# EAGLE design mlc (EAGLE 5.11)
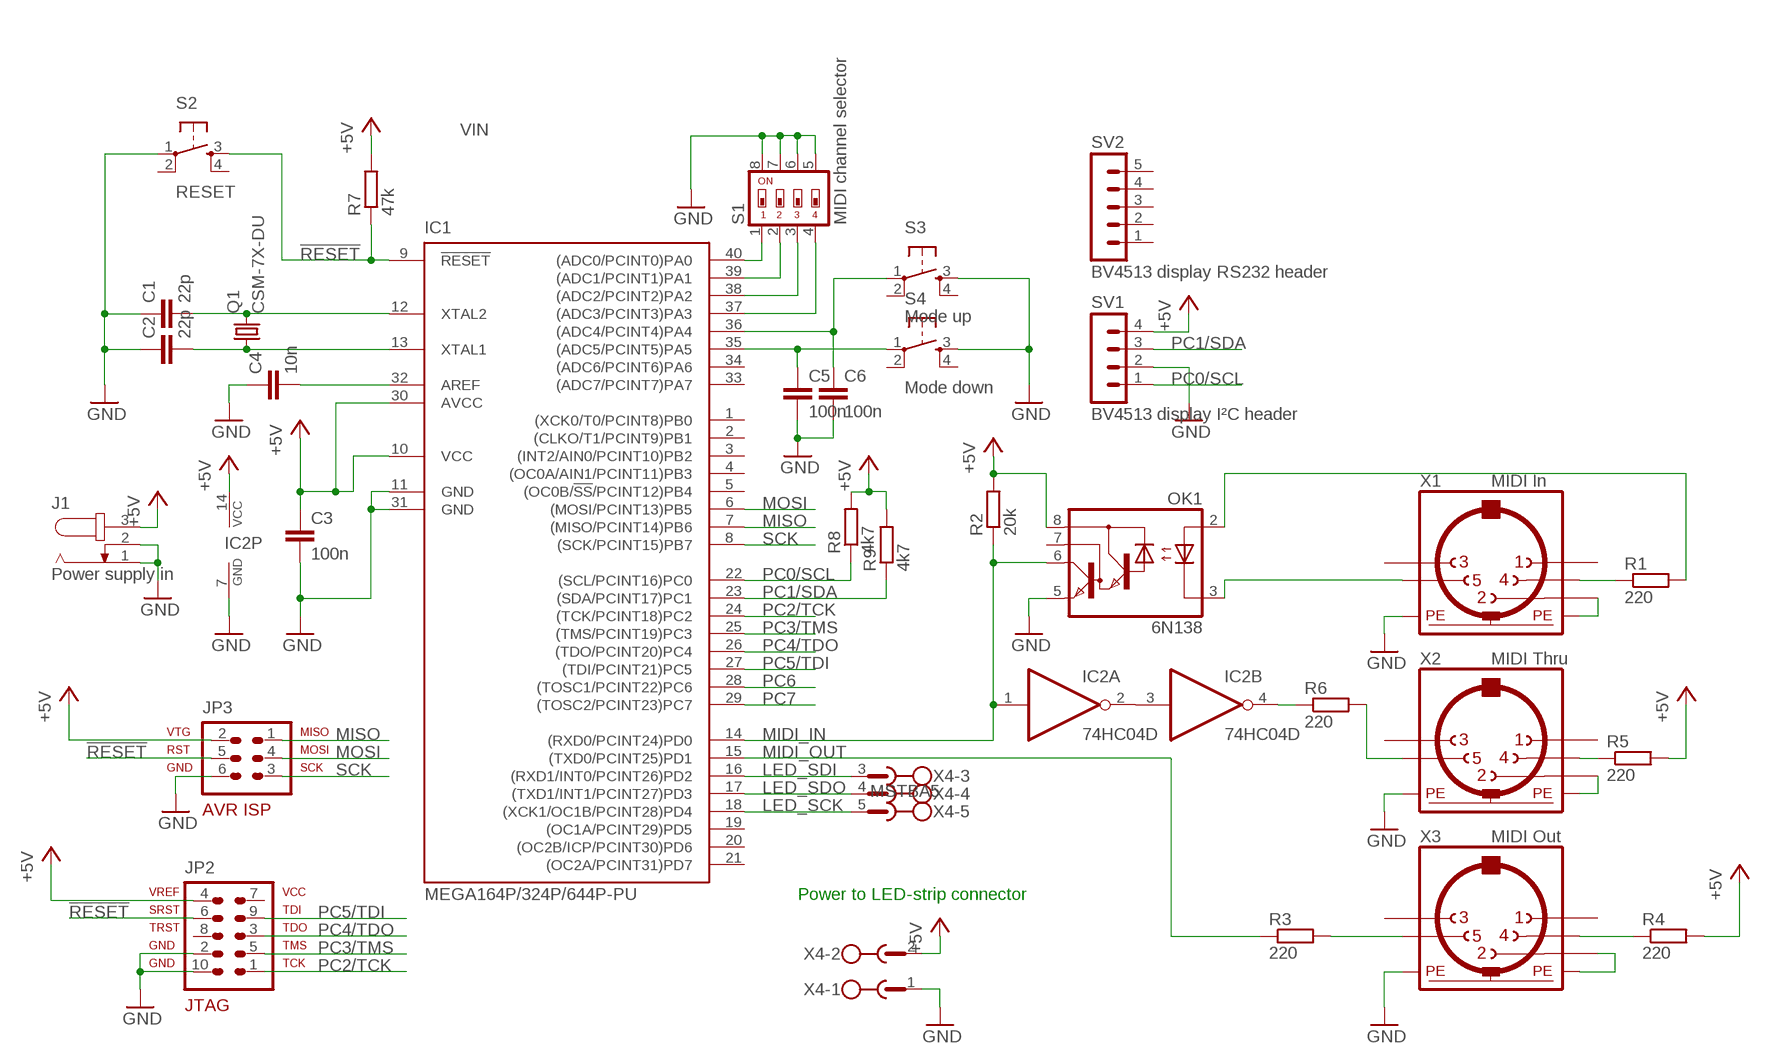
[diagram p0: schematic, sheet 1]

## Parts
C1  22p  C-EUC0603  [C0603]
C2  22p  C-EUC0603  [C0603]
C3  100n  C-EU025-030X050  [C025-030X050]
C4  10n  C-EUC0603  [C0603]
C5  100n  C-EUC0603  [C0603]
C6  100n  C-EUC0603  [C0603]
IC1  MEGA164P/324P/644P-PU  [DIL40]
IC2  74HC04D  [SO14]
J1  Power supply in  JACK-PLUG0  [SPC4077]
JP2  AVR-JTAG-10-R  [AVR-JTAG-10R]
JP3  AVR-ISP-6R  [AVR-ISP-6R]
OK1  6N138  [DIL08]
Q1  CSM-7X-DU  [CSM-7X-DU]
R1  220  R-EU_R0603  [R0603]
R2  20k  R-EU_0207/12  [0207/12]
R3  220  R-EU_R0603  [R0603]
R4  220  R-EU_R0603  [R0603]
R5  220  R-EU_R0603  [R0603]
R6  220  R-EU_R0603  [R0603]
R7  47k  R-EU_R0603  [R0603]
R8  4k7  R-EU_R0603  [R0603]
R9  4k7  R-EU_R0603  [R0603]
S1  MIDI channel selector  SWS004  [SMS-004]
S2  RESET  TAC_SWITCHPTH  [TACTILE-PTH]
S3  Mode up  TAC_SWITCHPTH  [TACTILE-PTH]
S4  Mode down  TAC_SWITCHPTH  [TACTILE-PTH]
SV1  BV4513 display I²C header  MA04-1  [MA04-1]
SV2  BV4513 display RS232 header  MA05-1  [MA05-1]
X1  MIDI In  MAB5SH  [MAB5SH]
X2  MIDI Thru  MAB5SH  [MAB5SH]
X3  MIDI Out  MAB5SH  [MAB5SH]
X4  MSTBA5  [MSTBA5]

## Nets
!RESET [signal]: IC1.9(!RESET) JP2.6 JP3.5 R7.1 S2.3
AREF: C4.2 IC1.32(AREF)
GND: C1.1 C2.1 C3.2 C4.1 C5.2 C6.2 IC1.11(GND) IC1.31(GND) IC2.7(P:GND) J1.1 J1.2 JP2.2 JP2.10 JP3.6 OK1.5(GND) S1.5 S1.6 S1.7 S1.8 S2.1 S3.3 S4.3 SV1.2 X1.PE@(PE) X2.PE@(PE) X3.PE@(PE) X4.1
LED_SCK [signal]: IC1.18((XCK1/OC1B/PCINT28)PD4) X4.5
LED_SDI [signal]: IC1.16((RXD1/INT0/PCINT26)PD2) X4.3
LED_SDO [signal]: IC1.17((TXD1/INT1/PCINT27)PD3) X4.4
MIDI_C1 [signal]: IC1.39((ADC1/PCINT1)PA1) S1.2
MIDI_C2 [signal]: IC1.38((ADC2/PCINT2)PA2) S1.3
MIDI_C3 [signal]: IC1.37((ADC3/PCINT3)PA3) S1.4
MIDI_IN [signal]: IC1.14((RXD0/PCINT24)PD0) IC2.1(A:I) OK1.6(VO) R2.1
MIDI_OUT [midipower]: IC1.15((TXD0/PCINT25)PD1) R3.1
MISO [signal]: IC1.7((MISO/PCINT14)PB6) JP3.1
MODE_DOWN [signal]: C5.1 IC1.35((ADC5/PCINT5)PA5) S4.1
MODE_UP [signal]: C6.1 IC1.36((ADC4/PCINT4)PA4) S3.1
MOSI [signal]: IC1.6((MOSI/PCINT13)PB5) JP3.4
N$1 [midipower]: OK1.3(C) X1.5
N$2 [midipower]: R1.1 X1.4
N$3 [midipower]: OK1.2(A) R1.2
N$4: X1.2 X1.PE
N$6 [midipower]: R3.2 X3.5
N$8: X3.2 X3.PE
N$9 [midipower]: R4.1 X3.4
N$10 [midipower]: R5.1 X2.4
N$11: IC2.2(A:O) IC2.3(B:I)
N$12 [midipower]: IC2.4(B:O) R6.1
N$13 [midipower]: R6.2 X2.5
N$14: X2.2 X2.PE
N$15: C1.2 IC1.12(XTAL2) Q1.2
N$16: C2.2 IC1.13(XTAL1) Q1.1
N$18 [signal]: IC1.40((ADC0/PCINT0)PA0) S1.1
PC0/SCL [signal]: IC1.22((SCL/PCINT16)PC0) R8.1 SV1.1
PC1/SDA [signal]: IC1.23((SDA/PCINT17)PC1) R9.1 SV1.3
PC2/TCK [signal]: IC1.24((TCK/PCINT18)PC2) JP2.1
PC3/TMS [signal]: IC1.25((TMS/PCINT19)PC3) JP2.5
PC4/TDO [signal]: IC1.26((TDO/PCINT20)PC4) JP2.3
PC5/TDI [signal]: IC1.27((TDI/PCINT21)PC5) JP2.9
PC6 [signal]: IC1.28((TOSC1/PCINT22)PC6)
PC7 [signal]: IC1.29((TOSC2/PCINT23)PC7)
SCK [signal]: IC1.8((SCK/PCINT15)PB7) JP3.3
VIN [power]: C3.1 IC1.10(VCC) IC1.30(AVCC) IC2.14(P:VCC) J1.3 JP2.4 JP3.2 OK1.8(VCC) R2.2 R4.2 R5.2 R7.2 R8.2 R9.2 SV1.4 X4.2 ; supply symbol labelled +5V
Unconnected: IC1.1((XCK0/T0/PCINT8)PB0) IC1.2((CLKO/T1/PCINT9)PB1) IC1.3((INT2/AIN0/PCINT10)PB2) IC1.4((OC0A/AIN1/PCINT11)PB3) IC1.5((OC0B/!SS!/PCINT12)PB4) IC1.19((OC1A/PCINT29)PD5) IC1.20((OC2B/ICP/PCINT30)PD6) IC1.21((OC2A/PCINT31)PD7) IC1.33((ADC7/PCINT7)PA7) IC1.34((ADC6/PCINT6)PA6) IC2.5(C:I) IC2.6(C:O) IC2.8(D:O) IC2.9(D:I) IC2.10(E:O) IC2.11(E:I) IC2.12(F:O) IC2.13(F:I) JP2.7 JP2.8 OK1.7(VB) S2.2 S2.4 S3.2 S3.4 S4.2 S4.4 SV2.1 SV2.2 SV2.3 SV2.4 SV2.5 X1.1 X1.3 X2.1 X2.3 X3.1 X3.3

## Notes on the sheet
- Power to LED-strip connector

## Library data of the parts
C1 C2 C4 = rcl:C-EU: CAPACITOR, European symbol
C3 C5 C6 = resistor:C-EU: CAPACITOR, European symbol
IC1 = avr-5:MEGA164P/324P/644P-PU
IC2 = 74xx-eu:74*04: Hex INVERTER
J1 = con-jack:JACK-PLUG: DC POWER JACK Power Jack, DC, Right Angle, Through Hole, Rated 5A at 16VDC, PC Terminals Distributor: Farnell (www.Farnell.de) Drawing: 84N1161.pdf / 84N1162.pdf Manufacturer: SPC Technology (www.spctechnology.com) Type: SPC4077 / SPC 4078; OC_FARNELL: unknown; OC_NEWARK: unknown
JP2 = avr-6:AVR-JTAG-10: AVR JTAG Debug/Programming Header
JP3 = avr-6:AVR-ISP-6: AVR ISP-6 Serial Programming Header
OK1 = optocoupler:6N138: MOTOROLA OPTO COUPLER; MF: VISHAY/TELEFUNKEN; MPN: 6N138; OC_FARNELL: 9860150; OC_NEWARK: 35K5294
Q1 = crystal:CSM-7X-DU: SMD CRYSTAL Source: www.ecsxtal.com .. Crystal 3.6864MHz CSM_7X_DU.PDF; OC_FARNELL: unknown; OC_NEWARK: unknown
R1 = rcl:R-EU_: RESISTOR, European symbol
R2-R9 = resistor:R-EU_: RESISTOR, European symbol
S1 = smd-special:SWS004: SMD Dip Switch 4 pol.
S2-S4 = SparkFun:TAC_SWITCH: Momentary Switch Button commonly used for reset or general input. Spark Fun Electronics SKU : COM-00097
SV1 = con-lstb:MA04-1: PIN HEADER; OC_FARNELL: unknown; OC_NEWARK: unknown
SV2 = con-lstb:MA05-1: PIN HEADER; OC_FARNELL: unknown; OC_NEWARK: unknown
X1-X3 = con-hirschmann:MAB5SH: Female CONNECTOR 5 pins 90 deg. with shield, horizontal (DIN 41524); OC_FARNELL: 809883; OC_NEWARK: unknown
X4 = con-phoenix-508:MSTBA5: PHOENIX; MPN: 1757271; OC_FARNELL: 3705201; OC_NEWARK: 71C4164

## Net classes
1 signal: width 0.051 mm
2 midipower: width 0.508 mm
3 power: width 0.508 mm, clearance 0.508 mm to class 1, clearance 0.508 mm to class 2, clearance 0.508 mm
4 digitsink: width 0.102 mm

## Board
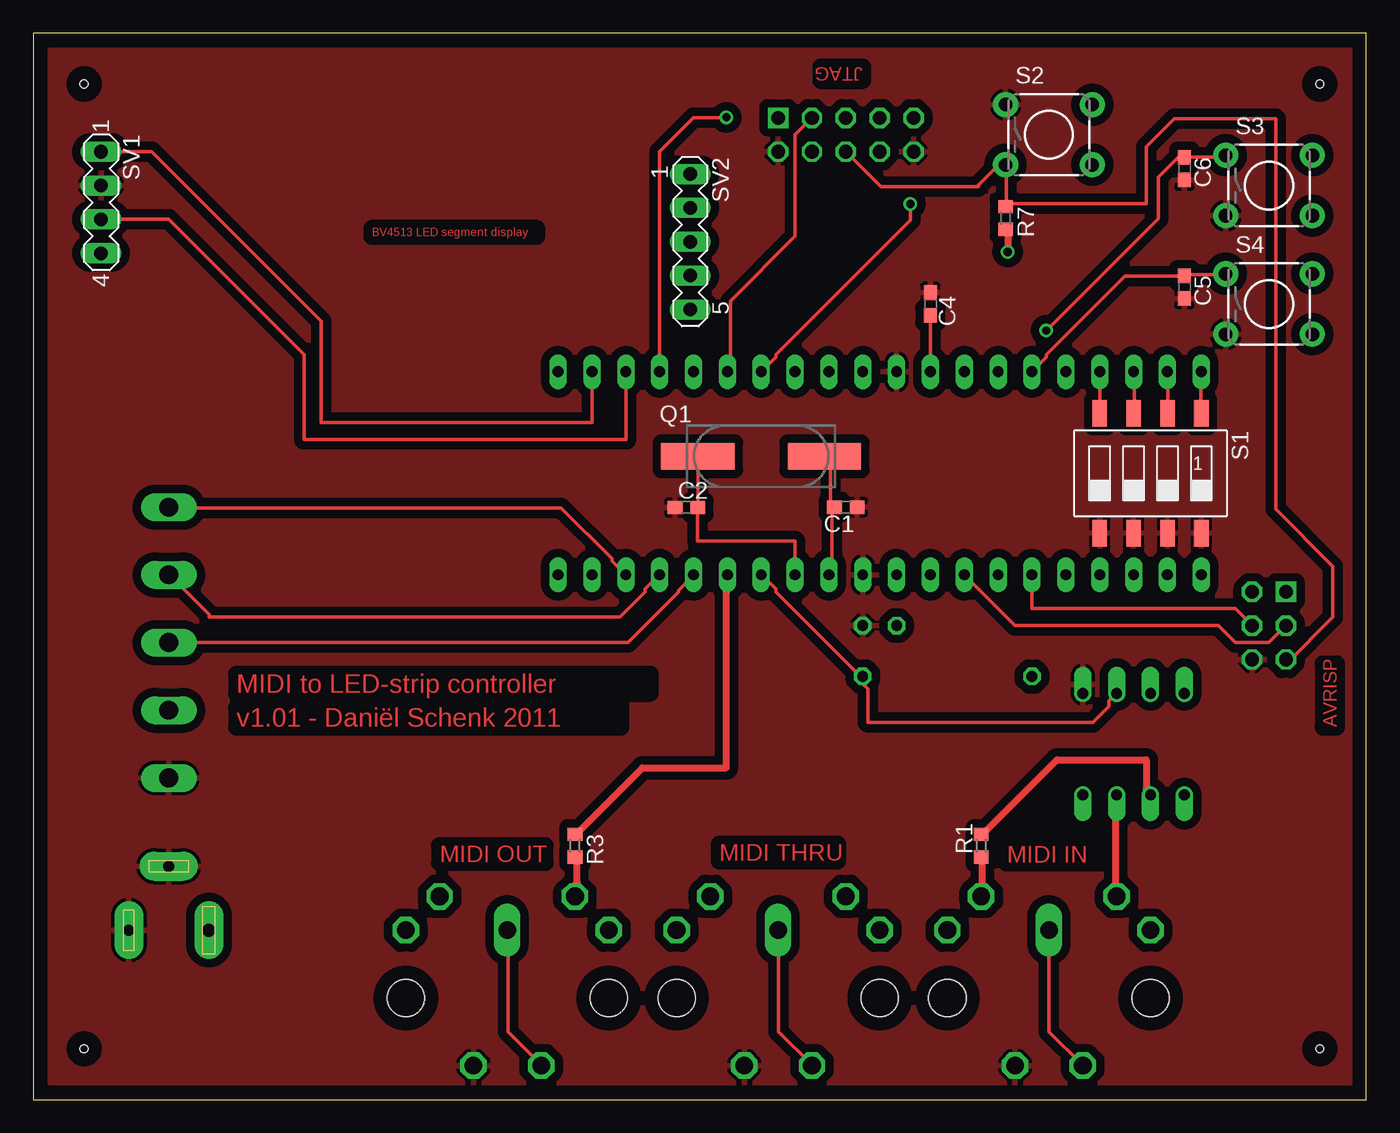
[diagram p1: board, top side]
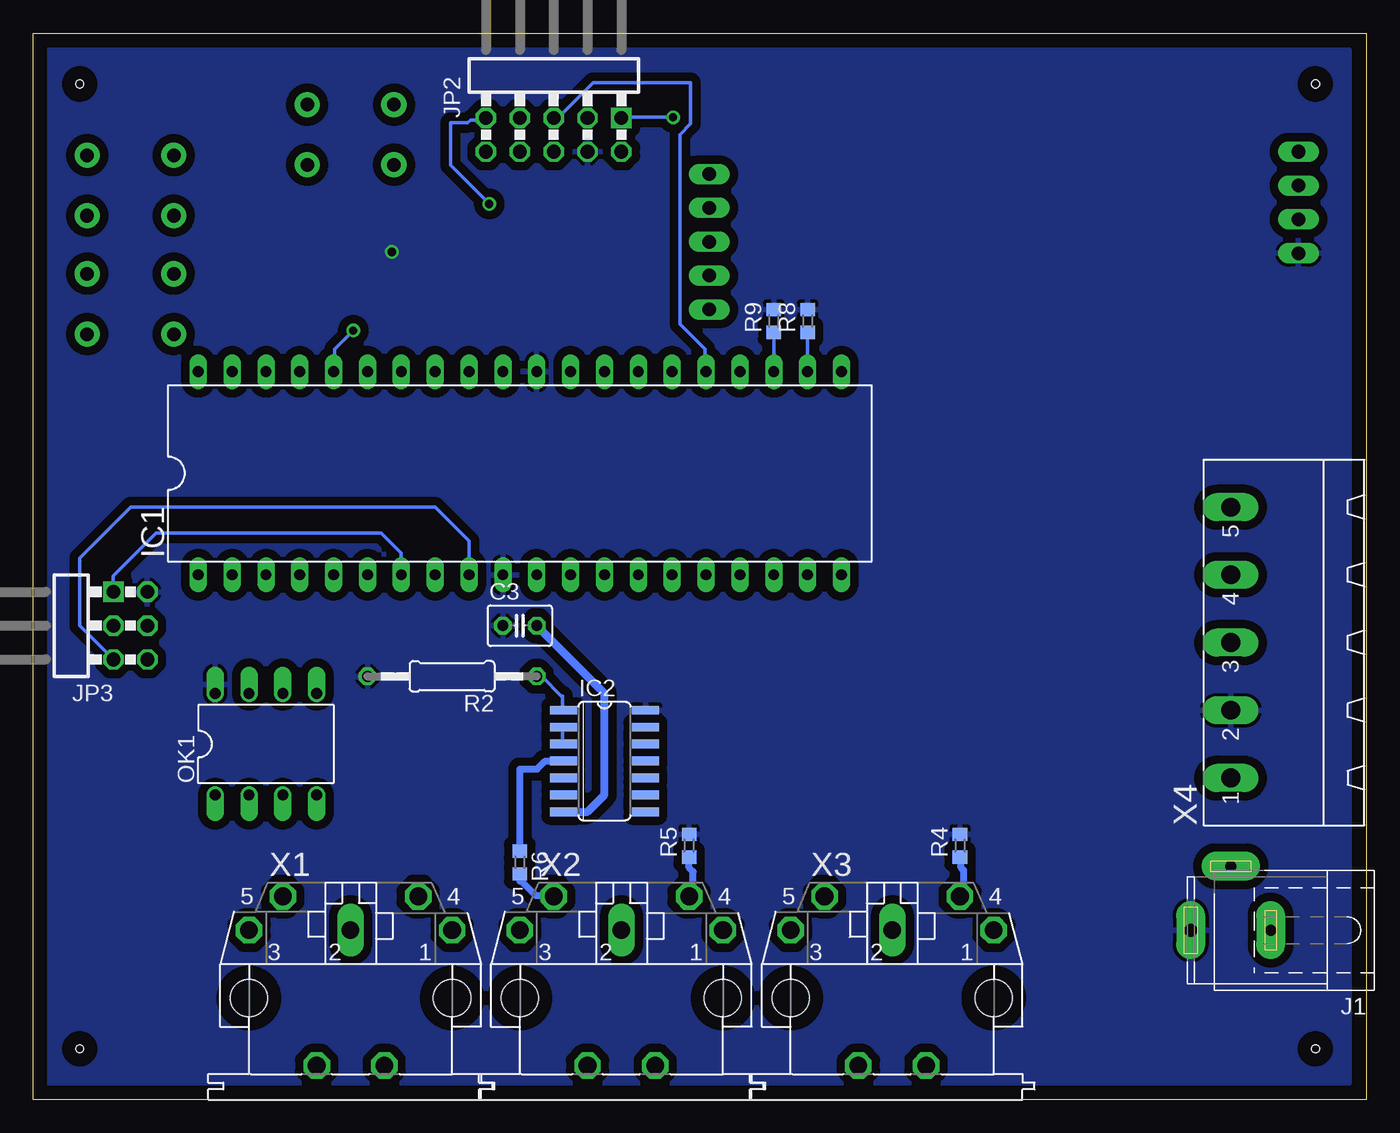
[diagram p2: board, bottom side, seen from below]

Size 100 x 80 mm. Coordinates in mm from the lower left corner, seen from the top.
Outline: 0,0 100,0 100,80 0,80 0,0
Copper layers (1*16): Top 0.035mm / dielectric 1.5mm / Bottom 0.035mm
Design rules "default *": minimum track width 10mil, minimum drill 24mil, track to track 25mil, track to pad 25mil, pad to pad 25mil, via to via 25mil, smd to smd 25mil, copper to edge 40mil, drill to drill 8mil, minimum pad ring 10mil, minimum via ring 8mil, stop-mask expansion 4mil, vias tented up to drill 0mil, thermal gap 10mil
Holes 0.6 mm at 3.81,76.2 96.52,76.2 96.52,3.81 3.81,3.81

### Footprints (pad centres in the part's own frame; a part is rotated, then mirrored left to right if it is on the bottom)
C0603 = smd 1.1 x 1: 1 -0.85,0; 2 0.85,0
C025-030X050 = drill 0.813 octagon: 1 -1.27,0; 2 1.27,0
DIL40 = drill 0.813 long: 1 -24.13,-7.62; 2 -21.59,-7.62; 3 -19.05,-7.62; 4 -16.51,-7.62; 5 -13.97,-7.62; 6 -11.43,-7.62; 7 -8.89,-7.62; 8 -6.35,-7.62; 9 -3.81,-7.62; 10 -1.27,-7.62; 11 1.27,-7.62; 12 3.81,-7.62; 13 6.35,-7.62; 14 8.89,-7.62; 15 11.43,-7.62; 16 13.97,-7.62; 17 16.51,-7.62; 18 19.05,-7.62; 19 21.59,-7.62; 20 24.13,-7.62; 21 24.13,7.62; 22 21.59,7.62; 23 19.05,7.62; 24 16.51,7.62; 25 13.97,7.62; 26 11.43,7.62; 27 8.89,7.62; 28 6.35,7.62; 29 3.81,7.62; 30 1.27,7.62; 31 -1.27,7.62; 32 -3.81,7.62; 33 -6.35,7.62; 34 -8.89,7.62; 35 -11.43,7.62; 36 -13.97,7.62; 37 -16.51,7.62; 38 -19.05,7.62; 39 -21.59,7.62; 40 -24.13,7.62
SO14 = smd 0.66 x 2.032: 1 -3.81,-3.073; 2 -2.54,-3.073; 3 -1.27,-3.073; 4 0,-3.073; 5 1.27,-3.073; 6 2.54,-3.073; 7 3.81,-3.073; 8 3.81,3.073; 9 2.54,3.073; 10 1.27,3.073; 11 0,3.073; 12 -1.27,3.073; 13 -2.54,3.073; 14 -3.81,3.073
SPC4077 = drill 0.8 pad 2.184 long: 1 -3,0; 2 0,-4.8 | drill 1 pad 2.184 long: 3 3,0
AVR-JTAG-10R = drill 1.016 square: 1 -5.08,-1.27 | drill 1.016 octagon: 2 -5.08,1.27; 3 -2.54,-1.27; 4 -2.54,1.27; 5 0,-1.27; 6 0,1.27; 7 2.54,-1.27; 8 2.54,1.27; 10 5.08,1.27 | drill 1.016 pad 1.422 octagon: 9 5.08,-1.27
AVR-ISP-6R = drill 1.016 square: 1 -2.54,-1.27 | drill 1.016 octagon: 2 -2.54,1.27; 3 0,-1.27; 4 0,1.27; 5 2.54,-1.27; 6 2.54,1.27
DIL08 = drill 0.813 offset: 1 -3.81,-3.81; 2 -1.27,-3.81; 3 1.27,-3.81; 4 3.81,-3.81; 5 3.81,3.81; 6 1.27,3.81; 7 -1.27,3.81; 8 -3.81,3.81
CSM-7X-DU = smd 5.5 x 2: 1 -4.75,0; 2 4.75,0
R0603 = smd 1 x 1.1: 1 -0.85,0; 2 0.85,0
0207/12 = drill 0.813 octagon: 1 -6.35,0; 2 6.35,0
SMS-004 = smd 1.092 x 2.007: 1 -3.81,-4.496; 2 -1.27,-4.496; 3 1.27,-4.496; 4 3.81,-4.496; 5 3.81,4.496; 6 1.27,4.496; 7 -1.27,4.496; 8 -3.81,4.496
TACTILE-PTH = drill 1.016 pad 1.88 round: 1 -3.251,2.261; 2 3.251,2.261; 3 -3.251,-2.261; 4 3.251,-2.261
MA04-1 = drill 1.016 long: 1 -3.81,0; 2 -1.27,0; 3 1.27,0; 4 3.81,0
MA05-1 = drill 1.016 long: 1 -5.08,0; 2 -2.54,0; 3 0,0; 4 2.54,0; 5 5.08,0
MAB5SH = drill 1.321 octagon: 1 7.62,5.08; 3 -7.62,5.08; 4 5.08,7.62; 5 -5.08,7.62; PE -2.54,-5.08; PE@ 2.54,-5.08 | drill 1.321 long: 2 0,5.08 | hole 2.794: 7.62,0; -7.62,0
MSTBA5 = drill 1.397 long: 1 -10.16,5.08; 2 -5.08,5.08; 3 0,5.08; 4 5.08,5.08; 5 10.16,5.08

### Placement (x,y rotation side)
C1  60.96,44.45 180 top
C2  49,44.42 0 top
C3  63.5,35.56 0 bottom
C4  67.31,59.69 270 top
C5  86.36,60.96 270 top
C6  86.36,69.85 270 top
IC1  63.5,46.99 0 bottom
IC2  57.15,25.4 270 bottom
J1  10.16,12.7 180 bottom
JP2  60.96,72.39 180 bottom
JP3  92.71,35.56 270 bottom
OK1  82.55,26.67 0 bottom
Q1  54.61,48.26 0 top
R1  71.12,19.05 90 top
R2  68.58,31.75 180 bottom
R3  40.64,19.05 270 top
R4  30.48,19.05 90 bottom
R5  50.8,19.05 90 bottom
R6  63.5,17.78 270 bottom
R7  72.96,66.14 270 top
R8  41.91,58.42 90 bottom
R9  44.45,58.42 90 bottom
S1  83.82,46.99 180 top
S2  76.2,72.39 0 top
S3  92.71,68.58 0 top
S4  92.71,59.69 0 top
SV1  5.08,67.31 270 top
SV2  49.29,64.37 270 top
X1  76.2,7.62 0 bottom
X2  55.88,7.62 0 bottom
X3  35.56,7.62 0 bottom
X4  5.08,34.29 90 bottom

### Tracks (layer width: path | path; a pad name or v marks a point on that pad's centre or on a via)
!RESET
  Top 0.254: JP2.6 61,71.1 63.6,68.5 70.9,68.5 70.9,68.6 72.2,69.9 72.9,69.9 S2.3 73,70.1 73,67 R7.1 73.1,67.2 83.5,67.2 83.5,71.5 85.6,73.6 93.2,73.6 93.2,44.3 97.5,40 97.5,36.2 94,32.7 JP3.5 93.9,33 93.9,32.7
  Bottom 0.254: IC1.9 67.31,41.91 69.85,44.45 92.71,44.45 96.52,40.64 96.52,35.56 JP3.5
AREF
  Top 0.254: C4.2 67.3,58.8 67.3,54.7 IC1.32
GND
  Bottom 0.61: IC2.7 58.42,21.59 57.15,22.86 57.15,30.48 C3.2
  pour Top: 1.27,78.74 99.06,78.74 99.06,1.27 1.27,1.27
LED_SCK
  Top 0.254: IC1.18 44.4,39.4 43.4,40.4 43.4,40.6 39.6,44.4 10.2,44.4 X4.5
LED_SDI
  Top 0.254: IC1.16 49.5,39.3 48.4,38.2 48.4,38.1 44.6,34.3 10.2,34.3 X4.3
LED_SDO
  Top 0.254: IC1.17 46.9,39.3 45.9,38.3 45.9,38.1 44,36.2 13.2,36.2 13.2,36.4 10.2,39.4 X4.4
MIDI_C1
  Top 0.254: S1.2 IC1.39
MIDI_C2
  Top 0.254: S1.3 82.6,51.5 82.6,54.6 IC1.38
MIDI_C3
  Top 0.254: S1.4 IC1.37
MIDI_IN
  Top 0.254: IC1.14 54.7,39.3 55.7,38.3 55.7,38.1 62,31.8 62.2,31.8 R2.1 62.3,31.7 62.3,31.1 62.6,30.8 62.6,28.3 79.5,28.3 80.7,29.5 80.7,29.9 OK1.6
  Bottom 0.254: IC2.1 60.3,29.3 60.3,30.3 60.4,30.3 61.8,31.7 62.2,31.7 R2.1
MIDI_OUT
  Top 0.508: R3.1 40.7,19.9 45.7,24.9 52,24.9 52,39.3 IC1.15
MISO
  Bottom 0.254: IC1.7 72.4,39.4 72.4,41 73.9,42.5 90.8,42.5 94,39.3 94,38.1 JP3.1
MODE_DOWN
  Top 0.254: S4.1 89.4,61.9 86.4,61.9 C5.1 86.3,61.8 81.9,61.8 76,55.9 76,55.7 75,54.7 IC1.35
MODE_UP  (via drill 0.61)
  Top 0.254: S3.1 89.4,70.8 89.4,70.7 C6.1 85.9,70.7 84.4,69.2 84.4,66.1 v76,57.7
  Bottom 0.254: v76,57.7 77.4,56.3 77.4,54.7 IC1.36
MOSI
  Top 0.254: 91.4,35.2 91.4,35.5 JP3.4 90.17,36.83 74.93,36.83 IC1.6
N$1
  Top 0.508: OK1.3 81.2,22.8 81.2,15.3 X1.5
N$2
  Top 0.508: R1.1 71.2,18.2 71.2,15.3 X1.4
N$3
  Top 0.508: R1.2 71.2,19.9 76.8,25.5 83.5,25.5 83.5,23.3 83.8,23 83.8,22.9 OK1.2
N$4
  Top 0.254: X1.2 76.2,5.1 78.7,2.6 X1.PE
N$6
  Top 0.508: R3.2 40.7,18.2 40.8,18.1 40.8,16.3 40.7,16.2 40.7,15.3 X3.5
N$8
  Top 0.254: X3.PE 38.1,2.6 35.6,5.1 35.6,12.7 X3.2
N$9
  Bottom 0.508: R4.1 30.4,18.2 30.4,17.4 30.2,17.2 30.2,15.3 30.4,15.3 X3.4
N$10
  Bottom 0.508: R5.1 50.8,17.4 50.5,17.1 50.5,15.3 50.8,15.3 X2.4
N$11
  Bottom 0.254: IC2.3 60.3,26.7 60.3,27.9 IC2.2
N$12
  Bottom 0.508: R6.1 63.5,24.8 62.2,24.8 61.6,25.4 IC2.4
N$13
  Bottom 0.508: R6.2 63.5,16.4 63.4,16.4 62.3,15.3 61,15.3 X2.5
N$14
  Top 0.254: X2.PE 58.4,2.6 55.9,5.1 55.9,12.7 X2.2
N$15
  Top 0.254: Q1.2 59.4,48.2 59.8,47.8 59.8,44.8 60.1,44.5 C1.2 59.9,44.6 59.9,39.6 59.7,39.4 IC1.12
N$16
  Top 0.254: Q1.1 C2.2 49.85,41.91 57.15,41.91 IC1.13
N$18
  Top 0.254: S1.1 87.6,51.5 87.6,54.6 IC1.40
PC0/SCL
  Top 0.254: 41.9,54.7 IC1.22 41.91,50.8 21.59,50.8 21.59,58.42 8.89,71.12 SV1.1
  Bottom 0.254: IC1.22 R8.1
PC1/SDA
  Top 0.254: IC1.23 44.45,49.53 20.32,49.53 20.32,55.88 10.16,66.04 SV1.3
  Bottom 0.254: IC1.23 R9.1
PC2/TCK  (via drill 0.61)
  Top 0.254: IC1.24 46.99,71.12 49.53,73.66 51.96,73.66 v52,73.7
  Bottom 0.254: v52,73.7 55.8,73.7 JP2.1
PC3/TMS
  Bottom 0.254: IC1.25 49.6,54.7 49.6,56.3 51.5,58.2 51.5,72.4 50.7,73.2 50.7,76.3 58,76.3 60.6,73.7 60.9,73.7 JP2.5
PC4/TDO
  Top 0.254: JP2.3 57.15,72.39 57.15,64.77 52.3,59.92 52.3,54.84 IC1.26
PC5/TDI  (via drill 0.61)
  Top 0.254: v65.8,67.2 65.8,66 55.7,55.9 55.7,55.7 IC1.27
  Bottom 0.254: v65.8,67.2 68.7,70.1 68.7,73.3 67.4,73.3 67.2,73.5 66.2,73.5 JP2.9
SCK
  Top 0.254: IC1.8 73.66,35.56 88.9,35.56 90.17,34.29 92.71,34.29 JP3.3
VIN  (via drill 0.61)
  Top 0.508: v73.1,63.6 73.1,65.1 73,65.2 R7.2
  pour Bottom: 1.27,78.74 99.06,78.74 99.06,1.27 1.27,1.27
  pour Bottom: 1.27,78.74 99.06,78.74 99.06,1.27 1.27,1.27

### Text on the board
Top: JTAG | BV4513 LED segment display | MIDI to LED-strip controller | v1.01 - Daniël Schenk 2011 | AVRISP | MIDI OUT | MIDI THRU | MIDI IN